# EAGLE design power_aug_25 (EAGLE 7.3.0)
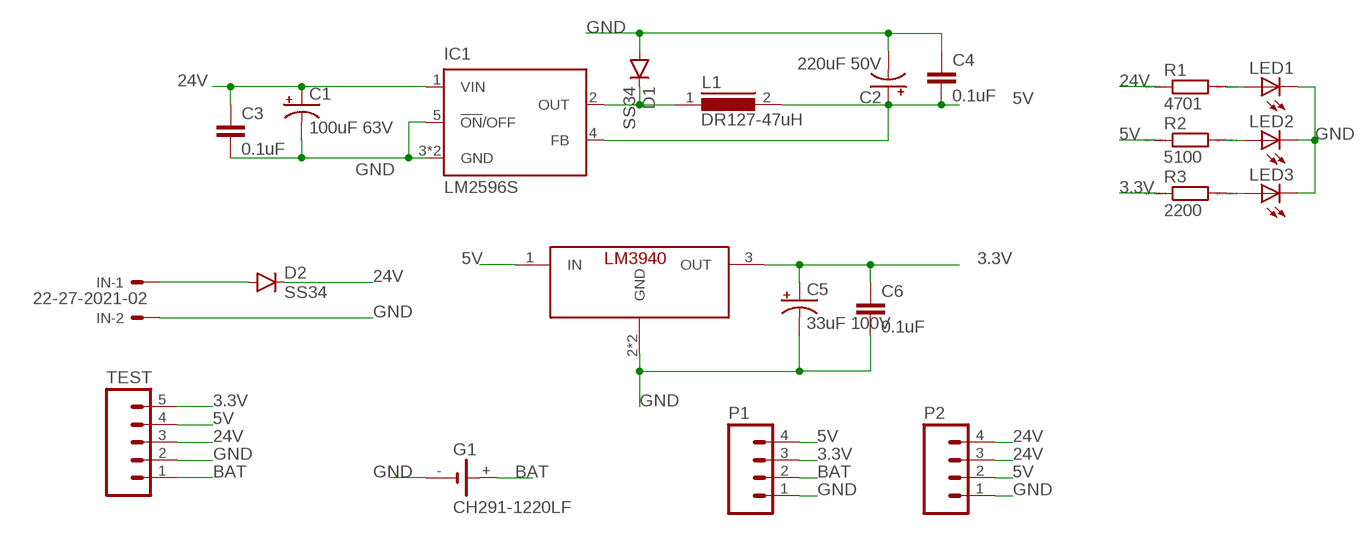
[diagram p0: schematic, sheet 1]

## Parts
C1  100uF 63V  100UF-63V-20%(ELECT)  [NIC_10X10.5_CAP]
C2  220uF 50V  100UF-63V-20%(ELECT)  [NIC_10X10.5_CAP]
C3  0.1uF  0.1UF-100V-10%(0603)  [0603-CAP]
C4  0.1uF  0.1UF-100V-10%(0603)  [0603-CAP]
C5  33uF 100V  100UF-63V-20%(ELECT)  [NIC_10X10.5_CAP]
C6  0.1uF  0.1UF-100V-10%(0603)  [0603-CAP]
D1  SS34  DIODESMA-ALT  [SMA-DIODE_ALT]
D2  SS34  DIODESMA-ALT  [SMA-DIODE_ALT]
G1  CH291-1220LF  [CH291-1220LF]
IC1  LM2596S  [TO263-5]
IN  22-27-2021-02  [6410-02]
L1  DR127-47uH  DR127  [DR127]
LED1  LEDCHIPLED_0805  [CHIPLED_0805]
LED2  LEDCHIPLED_0805  [CHIPLED_0805]
LED3  LEDCHIPLED_0805  [CHIPLED_0805]
P1  M04SMD2  [1X04-1MM-RA]
P2  M04SMD2  [1X04-1MM-RA]
R1  4701  RR0603  [R0603]
R2  5100  RR0603  [R0603]
R3  2200  RR0603  [R0603]
TEST  M05LOCK_LONGPADS  [1X05_LOCK_LONGPADS]
U$1  LM3940  [SOT223]

## Nets
3.3V: C5.+ C6.1 P1.3 R3.1 TEST.5 U$1.3(OUT)
5V: C2.+ C4.2 IC1.4(FB) L1.2 P1.4 P2.2 R2.1 TEST.4 U$1.1(IN)
24V: C1.+ C3.1 D2.C IC1.1(VIN) P2.3 P2.4 R1.1 TEST.3
BAT: G1.+ P1.2 TEST.1
GND: C1.- C2.- C3.2 C4.1 C5.- C6.2 D1.A G1.- IC1.3(GND) IC1.5(!ON!/OFF) IC1.6(GND) IN.2 LED1.C LED2.C LED3.C P1.1 P2.1 TEST.2 U$1.2(GND) U$1.4(GND)
N$1: D2.A IN.1
N$2: D1.C IC1.2(OUT) L1.1
N$7: LED1.A R1.2
N$8: LED2.A R2.2
N$9: LED3.A R3.2

## Library data of the parts
C1 C2 C5 = SparkFun-Capacitors:100UF-63V-20%(ELECT): CAP-08362 100uF electrolytic SMT 63V 20%; PROD_ID: CAP-08362; VALUE: 100uF
C3 C4 C6 = SparkFun-Capacitors:0.1UF-100V-10%(0603): CAP-08390; PROD_ID: CAP-08390
D1 D2 = SparkFun-DiscreteSemi:DIODE: Diode These are standard reverse protection diodes and small signal diodes. SMA package can handle up to about 1A. SOD-323 can handle about 200mA. What the SOD-323 package when ordering, there are some mfgs out there that are 5-pin packages.
G1 = battery:CH291-1220LF: Battery Holder, SMT, 12mm multicomp PART NO. CH291-1220LF Source: Data sheet <http://www.farnell.com/datasheets/1505860.pdf>
IC1 = national-semiconductor:LM2596: SIMPLE SWITCHER® Power Converter 150 kHz 3A Step-Down Voltage Regulator Source: http://www.national.com/ds/LM/LM2596.pdf; MF: NATIONAL SEMICONDUCTOR; MPN: LM2596S-ADJ/NOPB; OC_FARNELL: 9494367; OC_NEWARK: 41K3842
IN = con-molex:22-?-02: CONNECTOR wire to board 2.54 mm (.1 inch) pitch header; OC_FARNELL: unknown; OC_NEWARK: unknown
L1 = inductors:DR127: High Power Density, High Efficiency, Shielded Inductors Source: coiltronics_dr_series.pdf
LED1-LED3 = led:LED: LED OSRAM: - CHIPLED LG R971, LG N971, LY N971, LG Q971, LY Q971, LO R971, LY R971 LH N974, LH R974 LS Q976, LO Q976, LY Q976 LO Q996 - Hyper CHIPLED LW Q18S LB Q993, LB Q99A, LB R99A - SideLED LS A670, LO A670, LY A670, LG A670, LP A670 LB A673, LV A673, LT A673, LW A673 LH A674 LY A675 LS A676, LA A676, LO A676, LY A676, LW A676 LS A679, LY A679, LG A679 - Hyper Micro SIDELED® LS Y876, LA Y876, LO Y876, LY Y876 LT Y87S - SmartLED LW L88C, LW L88S LB L89C, LB L89S, LG L890 LS L89K, LO L89K, LY L89K LS L896, LA L896, LO L896, LY L896 - TOPLED LS T670, LO T670, LY T670, LG T670, LP T670 LSG T670, LSP T670, LSY T670, LOP T670, LYG T670 LG T671, LOG T671, LSG T671 LB T673, LV T673, LT T673, LW T673 LH T674 LS T676, LA T676, LO T676, LY T676, LB T676, LH T676, LSB T676, LW T676 LB T67C, LV T67C, LT T67C, LS T67K, LO T67K, LY T67K, LW E67C LS E67B, LA E67B, LO E67B, LY E67B, LB E67C, LV E67C, LT E67C LW T67C LS T679, LY T679, LG T679 LS T770, LO T770, LY T770, LG T770, LP T770 LB T773, LV T773, LT T773, LW T773 LH T774 LS E675, LA E675, LY E675, LS T675 LS T776, LA T776, LO T776, LY T776, LB T776 LHGB T686 LT T68C, LB T68C - Hyper Mini TOPLED® LB M676 - Mini TOPLED Santana® LG M470 LS M47K, LO M47K, LY M47K Source: http://www.osram.convergy.de LUXEON: - LUMILED® LXK2-PW12-R00, LXK2-PW12-S00, LXK2-PW14-U00, LXK2-PW14-V00 LXK2-PM12-R00, LXK2-PM12-S00, LXK2-PM14-U00 LXK2-PE12-Q00, LXK2-PE12-R00, LXK2-PE12-S00, LXK2-PE14-T00, LXK2-PE14-U00 LXK2-PB12-K00, LXK2-PB12-L00, LXK2-PB12-M00, LXK2-PB14-N00, LXK2-PB14-P00, LXK2-PB14-Q00 LXK2-PR12-L00, LXK2-PR12-M00, LXK2-PR14-Q00, LXK2-PR14-R00 LXK2-PD12-Q00, LXK2-PD12-R00, LXK2-PD12-S00 LXK2-PH12-R00, LXK2-PH12-S00 LXK2-PL12-P00, LXK2-PL12-Q00, LXK2-PL12-R00 Source: www.luxeon.com KINGBRIGHT: KA-3528ASYC Source: www.kingbright.com
P1 P2 = SparkFun-Connectors:M04: Header 4 Standard 4-pin 0.1" header. Use with straight break away headers (SKU : PRT-00116), right angle break away headers (PRT-00553), swiss pins (PRT-00743), machine pins (PRT-00117), and female headers (PRT-00115). Molex polarized connector foot print use with SKU : PRT-08231 with associated crimp pins and housings. 1MM SMD Version SKU: PRT-10208
R1-R3 = eagle-ltspice:R: RESISTOR, European symbol; SPICEMODEL: NONE; SPICEPREFIX: R
TEST = SparkFun-Connectors:M05: Header 5 Standard 5-pin 0.1" header. Use with straight break away headers (SKU : PRT-00116), right angle break away headers (PRT-00553), swiss pins (PRT-00743), machine pins (PRT-00117), and female headers (PRT-00115). Molex polarized connector foot print use with SKU : PRT-08230 with associated crimp pins and housings.
U$1 = SparkFun-PowerIC:LM3940

## Board
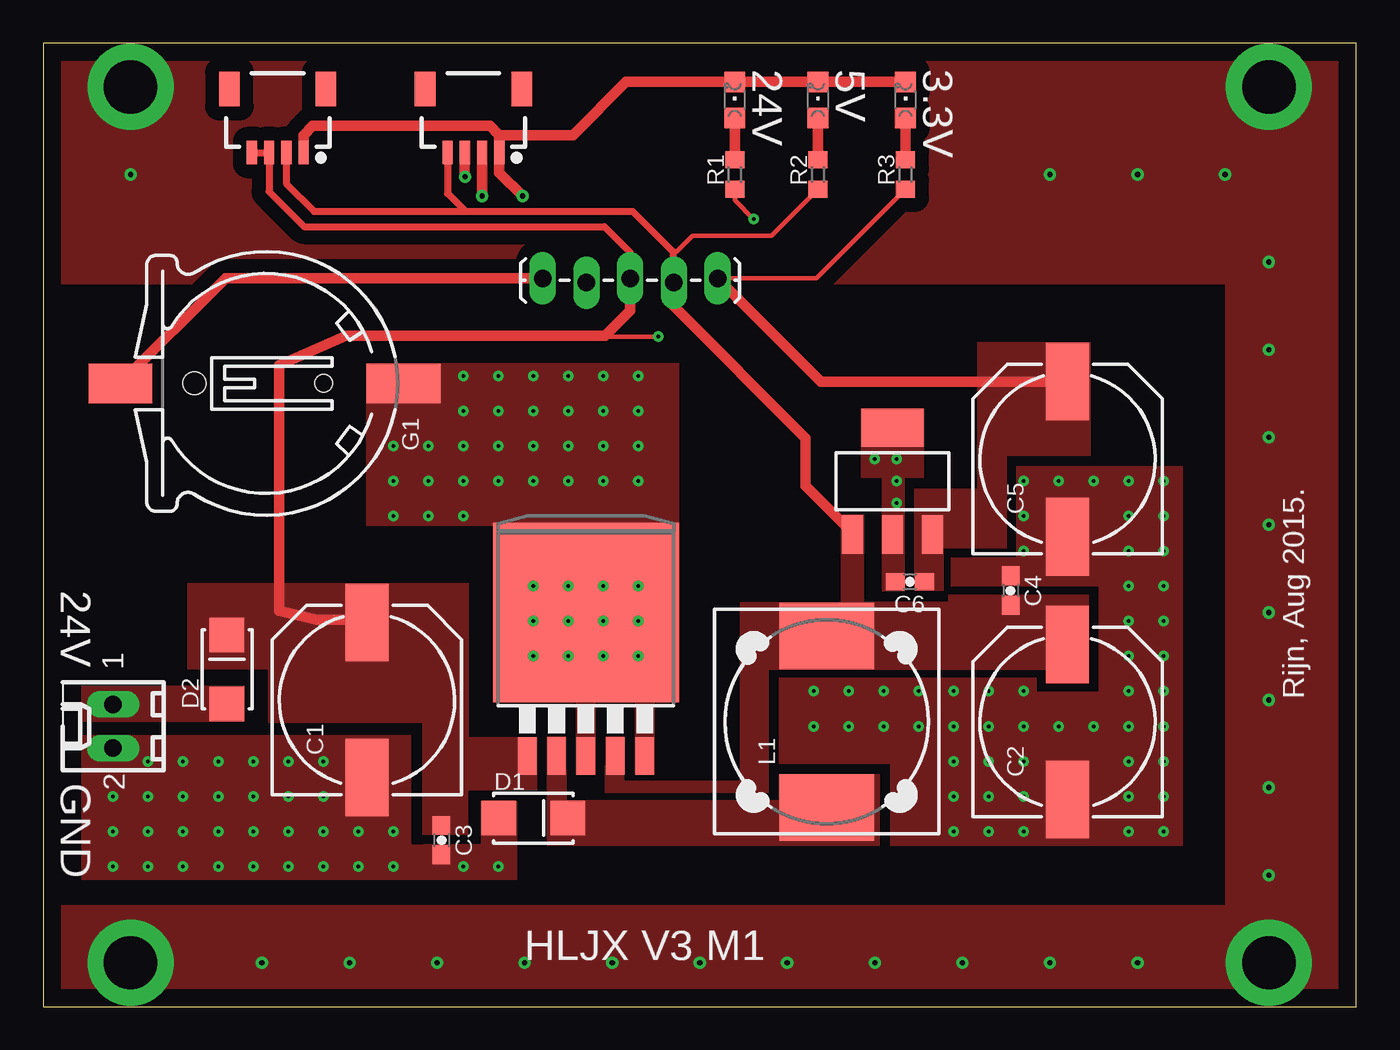
[diagram p1: board, top side]
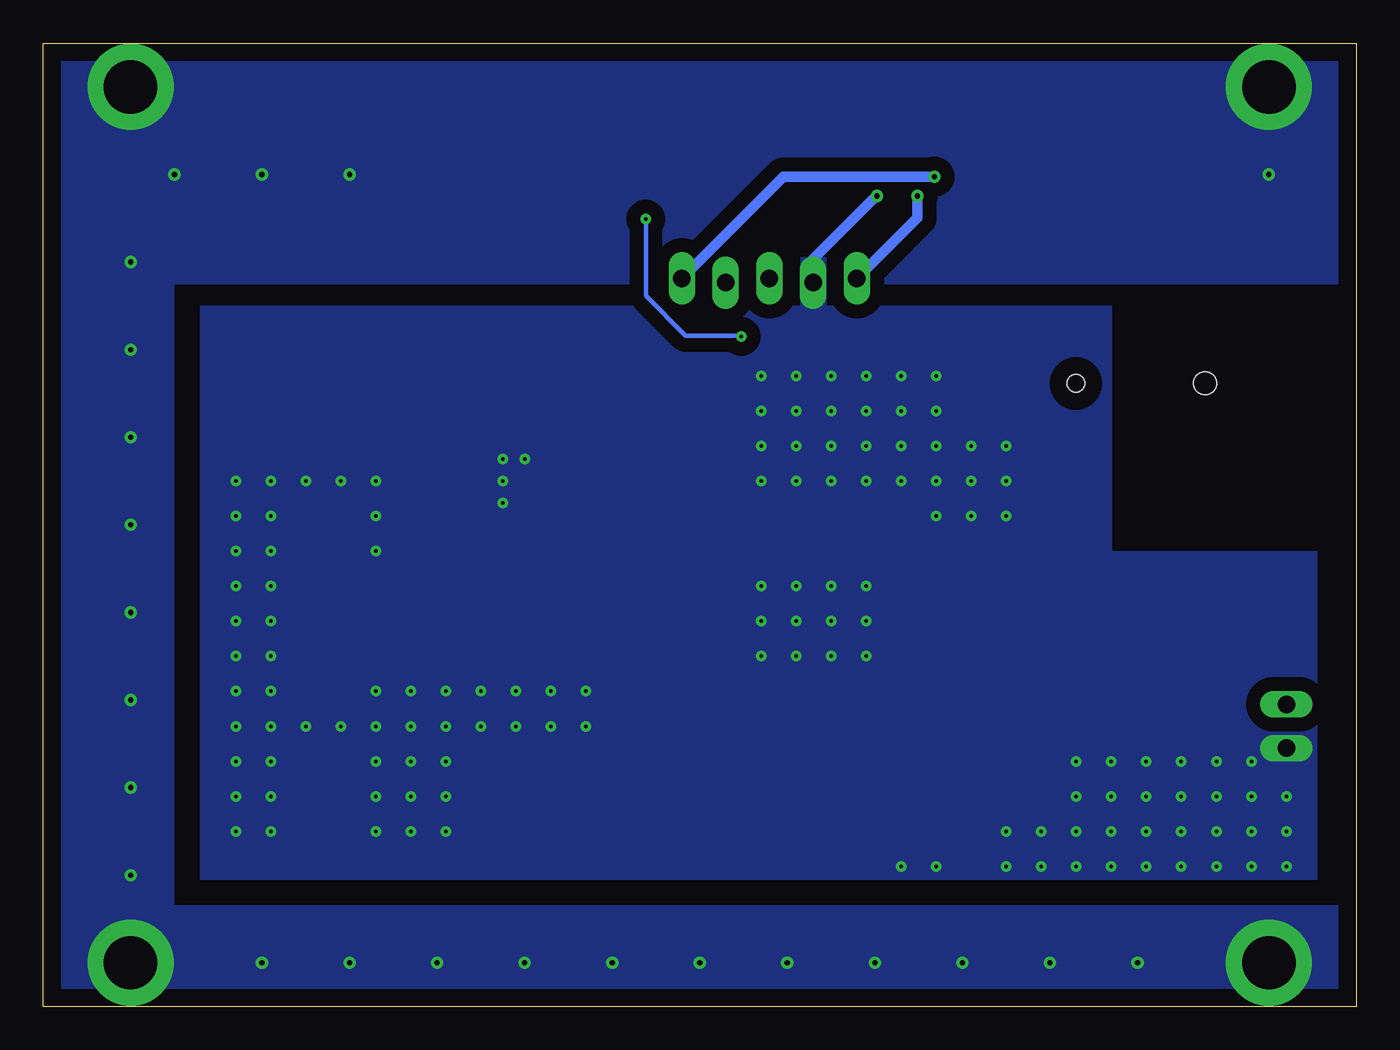
[diagram p2: board, bottom side, seen from below]

Size 76.2 x 55.88 mm. Coordinates in mm from the lower left corner, seen from the top.
Outline: 0,0 76.2,0 76.2,55.88 0,55.88 0,0
Copper layers (1*16): Top 0.035mm / dielectric 1.5mm / Bottom 0.035mm
Design rules "default": minimum track width 10mil, minimum drill 24mil, track to track 8mil, track to pad 8mil, pad to pad 8mil, via to via 8mil, smd to smd 8mil, copper to edge 40mil, drill to drill 8mil, minimum pad ring 10mil, minimum via ring 8mil, stop-mask expansion 4mil, vias tented up to drill 0mil, thermal gap 10mil

### Footprints (pad centres in the part's own frame; a part is rotated, then mirrored left to right if it is on the bottom)
NIC_10X10.5_CAP = smd 4.5 x 2.5: + 4.5,0; - -4.5,0
0603-CAP = smd 1.1 x 1: 1 -0.85,0; 2 0.85,0
SMA-DIODE_ALT = smd 2 x 2: A -2,0; C 2,0
CH291-1220LF = smd 2.3 x 3.66: + 0,-2.296 | smd 2.3 x 4.3: - 0,14.146 | hole 1.3: 0,2 | hole 1: 0,9.5
TO263-5 = smd 1.067 x 2.159: 1 -3.404,-5.791; 2 -1.702,-5.791; 3 0,-5.791; 4 1.702,-5.791; 5 3.404,-5.791 | smd 10.8 x 10.41: 6 0,2.54
6410-02 = drill 1.016 long: 1 1.27,0; 2 -1.27,0
DR127 = smd 3.85 x 5.5: 1 -4.975,0; 2 4.975,0
CHIPLED_0805 = smd 1.2 x 1.2: A 0,-1.05; C 0,1.05
1X04-1MM-RA = smd 0.6 x 1.35: 1 -1.5,0; 2 -0.5,0; 3 0.5,0; 4 1.5,0 | smd 1.2 x 2: NC1 2.8,-3.675; NC2 -2.8,-3.675
R0603 = smd 1 x 1.1: 1 -0.85,0; 2 0.85,0
1X05_LOCK_LONGPADS = drill 1.016 long: 1 0,0; 2 2.54,-0.254; 3 5.08,0; 4 7.62,-0.254; 5 10.16,0
SOT223 = smd 1.219 x 2.235: 1 -2.311,-3.099; 2 0,-3.099; 3 2.311,-3.099 | smd 3.6 x 2.2: 4 0,3.099

### Placement (x,y rotation side)
C1  18.8,17.78 90 top
C2  59.44,16.51 90 top
C3  23.11,9.65 270 top
C4  56.13,24.13 270 top
C5  59.44,31.75 90 top
C6  50.29,24.64 180 top
D1  28.45,10.92 0 top
D2  10.67,19.56 90 top
G1  6.78,36.14 270 top
IC1  31.5,20.32 0 top
IN  4.06,16.26 90 top
L1  45.47,16.51 90 top
LED1  40.13,52.58 0 top
LED2  44.96,52.58 0 top
LED3  50.04,52.58 0 top
P1  24.97,49.53 180 top
P2  13.61,49.53 180 top
R1  40.13,48.26 90 top
R2  44.96,48.26 90 top
R3  50.04,48.26 90 top
TEST  28.98,42.24 0 top
U$1  49.28,30.48 0 top

### Tracks (layer width: path | path; a pad name or v marks a point on that pad's centre or on a via)
3.3V  (via drill 0.3)
  Top 0.254: TEST.5 44.87,42.24 R3.1
  Top 0.61: TEST.5 45.13,36.25 C5.+ | P1.3 24.47,48.15 v24.49,48.13
  Bottom 0.61: v24.49,48.13 33.25,48.13 TEST.5
  pour Top (no thermals): 50.98,28.52 52.22,28.52 52.22,24.13 50.6,24.13 50.6,28.52
  pour Top (no thermals): 60.73,38.53 60.73,31.95 55.88,31.95 55.88,26.57 50.6,26.57 50.6,30.02 54.23,30.02 54.23,38.53
5V
  Top 0.254: 36.55,43.79 36.75,43.79 37.67,44.7 42.25,44.7 R2.1
  Top 0.406: P2.2 14.11,47.73 15.72,46.13 24.51,46.13 | 24.51,46.13 34.21,46.13 36.55,43.79 36.55,42.04 TEST.4 | P1.4 23.47,47.17 24.51,46.13
  Top 0.61: TEST.4 36.6,40.62 44.25,32.97 44.25,30.2 46.97,27.48 U$1.1
  pour Top (no thermals): 32.64,15.62 32.61,12.42 42.09,12.42 42.09,19.56 48.23,19.56 48.23,23.42 40.44,23.42 40.44,13.06 33.71,13.06 33.71,15.62
  pour Top (no thermals): 46.35,28.52 47.6,28.52 47.6,22.2 46.33,22.2 46.33,28.52
  pour Top (no thermals): 60.68,23.19 60.68,23.85 52.53,23.85 52.53,23.44 47.35,23.44 47.35,19.56 60.68,19.56
24V  (via drill 0.2)
  Top 0.254: R1.1 40.13,46.76 v41.22,45.67 | v35.69,38.86 32.23,38.86 32.18,38.91
  Top 0.406: P2.4 P2.3 13.11,47.26 15.14,45.24 32.56,45.24 34.06,43.74 TEST.3
  Top 0.61: TEST.3 34.06,40.36 32.61,38.91 32.18,38.91 17.58,38.91 13.69,37.19 13.69,22.96 15.88,22.43 18.65,22.43 C1.+
  Bottom 0.254: v41.22,45.67 41.22,41.22 38.91,38.91 35.74,38.91 v35.69,38.86
  pour Top (no thermals): 28.63,15.62 28.63,12.55 24.64,12.55 24.64,9.96 22.05,9.96 22.05,16.46 13.08,16.46 13.08,19.56 8.43,19.56 8.43,24.56 24.66,24.56 24.66,15.62
BAT  (via drill 0.3)
  Top 0.61: TEST.1 10.58,42.24 G1.+ | P1.2 25.47,47.58 v25.48,47.02
  Bottom 0.61: v25.48,47.02 25.48,45.74 TEST.1
GND  (via drill 0.2, 0.3)
  Top 0.61: P2.1 15.11,50.55 15.65,51.08 25.93,51.08 26.47,50.55 | 26.47,50.55 P1.1 26.47,48.36 v27.81,47.02 | 26.47,50.55 30.73,50.55 33.83,53.65 40.12,53.65 LED1.C LED2.C LED3.C
  Bottom 0.61: v27.81,47.02 27.84,47.02 31.55,43.31 31.55,42.01 TEST.2
  other vias: 24.38,36.58 26.42,36.58 28.45,36.58 20.32,32.51 20.32,30.48 20.32,28.45 22.35,28.45 22.35,32.51 22.35,30.48 24.38,30.48 24.38,28.45 26.42,30.48 24.38,32.51 28.45,34.54 24.38,34.54 26.42,34.54 26.42,32.51 28.45,32.51 28.45,30.48 30.48,30.48 30.48,32.51 30.48,34.54 32.51,34.54 32.51,32.51 32.51,30.48 34.54,30.48 34.54,32.51 34.54,34.54 34.54,36.58 32.51,36.58 30.48,36.58 28.45,24.38 28.45,22.35 28.45,20.32 30.48,20.32 30.48,22.35 30.48,24.38 32.51,24.38 32.51,22.35 32.51,20.32 34.54,20.32 34.54,22.35 34.54,24.38 6.1,14.22 8.13,14.22 8.13,12.19 6.1,12.19 4.06,12.19 4.06,10.16 4.06,8.13 6.1,8.13 6.1,10.16 8.13,10.16 8.13,8.13 10.16,8.13 10.16,10.16 10.16,12.19 10.16,14.22 12.19,14.22 12.19,12.19 12.19,10.16 12.19,8.13 14.22,8.13 14.22,10.16 14.22,12.19 14.22,14.22 16.26,14.22 16.26,12.19 16.26,10.16 16.26,8.13 18.29,8.13 18.29,10.16 20.32,10.16 20.32,8.13 24.38,8.13 26.42,8.13 44.7,16.26 44.7,18.29 46.74,18.29 46.74,16.26 48.77,16.26 48.77,18.29 50.8,18.29 50.8,16.26 52.83,18.29 52.83,16.26 52.83,14.22 52.83,12.19 52.83,10.16 54.86,10.16 54.86,12.19 54.86,14.22 54.86,16.26 54.86,18.29 56.9,18.29 56.9,16.26 56.9,14.22 56.9,12.19 56.9,10.16 58.93,16.26 60.96,16.26 62.99,10.16 65.02,10.16 65.02,12.19 62.99,12.19 62.99,14.22 65.02,14.22 65.02,16.26 62.99,16.26 62.99,18.29 65.02,18.29 65.02,20.32 62.99,20.32 62.99,22.35 65.02,22.35 65.02,24.38 62.99,24.38 62.99,26.42 65.02,26.42 65.02,28.45 65.02,30.48 62.99,30.48 56.9,30.48 56.9,28.45 56.9,26.42 58.93,30.48 60.96,30.48 62.99,28.45 48.26,31.75 49.53,31.75 49.53,30.48 49.53,29.21
  pour Top (no thermals): 2.26,15.75 21.34,15.75 21.34,9.4 24.13,9.4 24.13,7.37 2.26,7.37
  pour Top (no thermals): 30.96,13.44 30.96,20.57 32.03,20.57 32.03,13.44
  pour Top (no thermals): 34.37,13.46 34.37,19.02 30.23,19.02 30.23,21.26 35.43,21.26 35.43,13.46
  pour Top (no thermals): 25.45,11.91 27.46,11.91 27.46,7.37 22.12,7.37 22.12,9.42 25.45,9.42
  pour Top (no thermals): 48.67,28.5 48.67,24.13 49.99,24.13 49.99,30.71 51.1,30.71 51.1,34.67 47.45,34.67 47.45,30.71 48.67,30.71
  pour Top (no thermals): 42.7,19.02 42.7,14.1 49.17,14.1 49.17,9.35 66.12,9.35 66.12,31.32 56.46,31.32 56.46,26.01 52.68,26.01 52.68,24.41 61.26,24.41 61.26,18.24 57.63,18.24 57.63,19.05 42.7,19.05
  pour Top (no thermals): 18.77,37.31 36.88,37.31 36.88,27.89 18.77,27.89
  pour Top (no thermals): 26.42,26.42 36.58,26.42 36.58,18.29 26.42,18.29
  pour Bottom (isolate 0.813, no thermals): 2.29,7.37 67.06,7.37 67.06,40.64 14.22,40.64 14.22,26.42 2.29,26.42
  pour Bottom (no thermals): 30.73,43.43 32.26,43.43 32.26,40.13 30.73,40.13
IGND  (via drill 0.3, 3.1 pad 5)
  other vias: 5.08,53.34 71.12,53.34 71.12,2.54 5.08,2.54 5.08,48.26 58.42,48.26 63.5,48.26 68.58,48.26 71.12,43.18 71.12,38.1 71.12,33.02 71.12,27.94 71.12,22.86 71.12,17.78 71.12,12.7 71.12,7.62 63.5,2.54 58.42,2.54 53.34,2.54 48.26,2.54 43.18,2.54 38.1,2.54 33.02,2.54 27.94,2.54 22.86,2.54 17.78,2.54 12.7,2.54
  pour Bottom (isolate 0.813, no thermals): -0.76,56.64 77.47,56.64 77.47,-1.27 -1.02,-1.27 -1.02,5.84 68.58,5.84 68.58,41.91 -0.76,41.91
  pour Top (isolate 0.813, no thermals): -1.27,-1.52 77.72,-1.52 77.72,57.4 -4.06,57.4 -4.06,41.91 68.58,41.91 68.58,5.84 -1.27,5.84
N$1
  pour Top (no thermals): 11.68,18.57 2.24,18.57 2.24,16.54 11.68,16.54
N$2
  pour Top (no thermals): 29.24,15.62 29.24,9.35 48.51,9.35 48.51,11.94 30.38,11.94 30.35,15.62
  pour Top (no thermals): 42.72,13.46 48.51,13.46 48.51,11.94 42.72,11.94
N$7
  Top 0.61: R1.2 LED1.A
N$8
  Top 0.61: R2.2 LED2.A
N$9
  Top 0.61: R3.2 LED3.A

### Text on the board
tNames: 24V | 5V | 3.3V | 24V | Rijn, Aug 2015. | GND | HLJX V3 M1